# Altium project L6234 BLDC Driver.PrjPcb
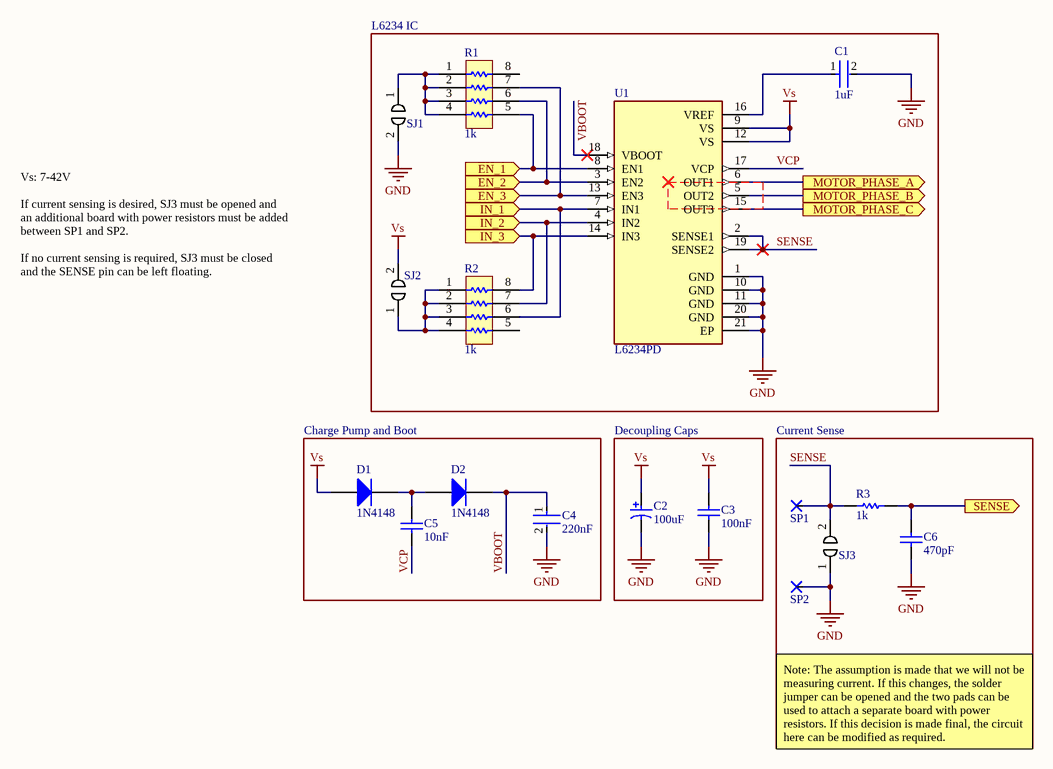
[diagram p0: L6234 BLDC Driver.SchDoc]
1 sheet, 17 parts. Net scope: flat (ports and power ports of the same name join across sheets).
Board file: L6234 BLDC Driver.PcbDoc

## Sheet L6234 BLDC Driver.SchDoc
size A4

### Parts
C1  1uF  [FP-CL21-IPC_A]
C2  100uF  [KEMT-T491-D_L]
C3  100nF  [CAPC2013X95X45ML10T25]
C4  220nF  [FP-CL549-IPC_C]
C5  10nF  [CAPC1005X55X25LL05T10]
C6  470pF  [CAPC0805(2012)75_M]
D1  1N4148  [VISH-SOD-323-2_V]
D2  1N4148  [VISH-SOD-323-2_V]
R1  1k  [BOUR-CAY16-J4_V]
R2  1k  [BOUR-CAY16-J4_V]
R3  1k  [RESC2013X70X40ML20T20]
SJ1  Jumper  [6MIL CIRCULAR]  (value not drawn)
SJ2  Jumper  [6MIL CIRCULAR]  (value not drawn)
SJ3  Jumper  [6MIL CIRCULAR]  (value not drawn)
SP1  Rectangular  [2.5x5mm]  (value not drawn)
SP2  Rectangular  [2.5x5mm]  (value not drawn)
U1  L6234PD  [SOIC127P1420X360-21N]

### Blocks framed on the sheet
L6234 IC: C1 R1 R2 SJ1 SJ2 U1
Charge Pump and Boot: C4 C5 D1 D2
Decoupling Caps: C2 C3
Current Sense: C6 R3 SJ3 SP1 SP2

### Ports
EN_1 (in), EN_2 (in), EN_3 (in), IN_1 (in), IN_2 (in), IN_3 (in), MOTOR_PHASE_A (out), MOTOR_PHASE_B (out), MOTOR_PHASE_C (out), SENSE (out)

### Nets
GND: C1.2 C2.2 C3.1 C4.2 C6.1 SJ1.2 SJ3.1 SP2.1 U1.1(GND) U1.10(GND) U1.11(GND) U1.20(GND) U1.21(EP)
Vs: C2.1 C3.2 D1.1(A) SJ2.2 U1.9(VS) U1.12(VS)
SENSE: R3.1 SJ3.2 SP1.1 U1.2(SENSE1) U1.19(SENSE2)
VBOOT: C4.1 D2.2(K) U1.18(VBOOT)
VCP: C5.1 U1.17(VCP)
NetC1_1: C1.1 U1.16(VREF)
NetC5_2: C5.2 D1.2(K) D2.1(A)
NetC6_2: C6.2 R3.2 ; port SENSE
NetR1_1: R1.1 R1.2 R1.3 R1.4 SJ1.1
NetR1_5: R1.5 U1.8(EN1) ; port EN_1
NetR1_6: R1.6 U1.3(EN2) ; port EN_2
NetR1_7: R1.7 U1.13(EN3) ; port EN_3
NetR2_1: R2.1 R2.2 R2.3 R2.4 SJ2.1
NetR2_6: R2.6 U1.7(IN1) ; port IN_1
NetR2_7: R2.7 U1.4(IN2) ; port IN_2
NetR2_8: R2.8 U1.14(IN3) ; port IN_3
NetU1_5: U1.5(OUT2) ; port MOTOR_PHASE_B
NetU1_6: U1.6(OUT1) ; port MOTOR_PHASE_A
NetU1_15: U1.15(OUT3) ; port MOTOR_PHASE_C

Not connected (* = marked no-connect by the designer): R1 8; R2 5

### Notes on the sheet
- Vs: 7-42V
  If current sensing is desired, SJ3 must be opened and an additional board with power resistors must be added between SP1 and SP2.
  If no current sensing is required, SJ3 must be closed and the SENSE pin can be left floating.
- Note: The assumption is made that we will not be measuring current. If this changes, the solder jumper can be opened and the two pads can be used to attach a separate board with power resistors. If this decision is made final, the circuit here can be modified as required.

### Library data of the parts
C1 = CMP-13271-003098-1: CL21 Series 0805 1uF 16V ±10% Tolerance X7R Multilayer Ceramic Chip Capacitor; Manufacturer: Samsung; Manufacturer Part Number: CL21B105KOFNNNE; Case Code (Metric): 2012; Width: 0.049inch; Thickness: 0.053inch; Voltage Rating: 16V; Max Operating Temperature: 125°C; Case Code (Imperial): 0805; Height: 1.25mm; Length: 2mm; Case/Package: 0805; Lead Free: Lead Free; Mount: Surface Mount; Capacitance: 1uF; Tolerance: 10%; Voltage Rating (DC): 16V; Min Operating Temperature: -55°C; Contact Plating: Tin; Depth: 1.25mm; Packaging: Tape and Reel; Package Quantity: 1; Voltage: 16V; Dielectric: X7R; Radiation Hardening: No; Supplier 1: LCSC; Supplier Part Number 1: C24123; RoHS: Yes; Category: Ceramic Capacitors; Stock 1: 102500; Pricing 1: 50=0.02040, 500=0.01510, 1500=0.01410, 5000=0.01310, 25000=0.01270, 50000=0.01250, 50=0.01950, 500=0.01440, 1500=0.01350, 5000=0.01260, 25000=0.01220, 50000=0.01200, 50=0.10220, 500=0.07570, 1500=0.07090, 5000=0.06600, 25000=0.06390, 50000=0.06280, 50=0.09230, 500=0.06840, 1500=0.06400, 5000=0.05960, 25000=0.05770, 50000=0.05670, 50=0.01240, 500=0.00920, 1500=0.00860, 5000=0.00800, 25000=0.00780, 50000=0.00760, 50=0.01130, 500=0.00830, 1500=0.00780, 5000=0.00730, 25000=0.00700, 50000=0.00690, 50=0.11320, 500=0.08390, 1500=0.07850, 5000=0.07310, 25000=0.07070, 50000=0.06950, 50=1.53440, 500=1.13720, 1500=1.06430, 5000=0.99120, 25000=0.95890, 50000=0.94280, 50=0.06190, 500=0.04590, 1500=0.04300, 5000=0.04000, 25000=0.03870, 50000=0.03810, 50=1.06060, 500=0.78600, 1500=0.73560, 5000=0.68510, 25000=0.66280, 50000=0.65170, 50=0.12760, 500=0.09450, 1500=0.08850, 5000=0.08240, 25000=0.07970, 50000=0.07840, 50=0.02010, 500=0.01490, 1500=0.01390, 5000=0.01300, 25000=0.01250, 50000=0.01230, 50=0.01460, 500=0.01082, 1500=0.01013, 5000=0.00943, 25000=0.00913, 50000=0.00897 (AUD); ComponentLink1URL: https://datasheet.ciiva.com/25800/cl21b105kofnnne-25800257.pdf?src-supplier=Digi-Key; ComponentLink1Description: https://datasheet.ciiva.com/25800/cl21b105kofnnne-25800257.pdf?src-supplier=Digi-Key; ComponentLink2URL: https://datasheet.ciiva.com/26838/getdatasheetpartid-358361-26838673.pdf?src-supplier=Verical; ComponentLink2Description: https://datasheet.ciiva.com/26838/getdatasheetpartid-358361-26838673.pdf?src-supplier=Verical; ComponentLink3URL: https://datasheet.ciiva.com/26310/mlcc-catalogdownload2013-eng-26310166.pdf?src-supplier=Distrelec; ComponentLink3Description: https://datasheet.ciiva.com/26310/mlcc-catalogdownload2013-eng-26310166.pdf?src-supplier=Distrelec; Supplier 2: Digi-Key; Supplier Part Number 2: 1276-1026-1-ND; Stock 2: 45318; Pricing 2: 1=0.10000, 10=0.06000, 50=0.03300, 100=0.02690, 500=0.01922, 1000=0.01509 (USD)
C2 = CMP-2000-07541-1: Tantalum Surface Mount Capacitor, 100 uF, +/- 10%, 16 V, -55 to 125 degC, 2917 (7343 Metric), RoHS, Tape and Reel; Manufacturer: Kemet; Manufacturer Part Number: T491D107K016AT; ESR (Equivalent Series Resistance): 700mOhm; Dissipation Factor: 8%; Voltage Rating (DC): 16V; Case\/Package: Molded; Polarity: Polar; Life (Hours): 2000Hour; Leakage Current: 16uA; Ripple Current: 463mA; RoHSCompliant: true; Datasheet Version: 07/2017; Case Code (Imperial): 2917; Width: 4.3mm; Height: 2.8mm; Min Operating Temperature: -55degC; Length: 7.3mm; Package Reference: T491-D; Dielectric Material: Tantalum; Packaging: TapeandReel; Max Operating Temperature: 125degC; Package Description: 2-Pin Surface Mount Device, Body 7.3 x 4.3 mm; Capacitance: 100uF; Package Quantity: 1; Lead Free: LeadFree; Case Code (Metric): 7343; Voltage: 16V; Voltage Rating: 16V; Tolerance: 10%; Weight: 0.023634oz; Termination: SMD/SMT; Lead Pitch: 3.6mm; Manufacturer URL: http://www.kemet.com/; Datasheet URL: http://www.kemet.com/Lists/ProductCatalog/Attachments/254/KEM_T2005_T491.pdf; Radiation Hardening: No; Mount: PCB; Height - Seated (Max): 0.122inch; Mounting Technology: SurfaceMount; Depth: 4.3mm; REACH SVHC: NoSVHC; Supplier 1: LCSC; Supplier Part Number 1: C110548; RoHS: Yes; Category: Tantalum Capacitors; Stock 1: 3642; Pricing 1: 1=0.76890, 10=0.56680, 30=0.52960, 100=0.49250, 500=0.47620, 1000=0.46920, 1=0.73630, 10=0.54280, 30=0.50720, 100=0.47160, 500=0.45600, 1000=0.44930, 1=3.86020, 10=2.84560, 30=2.65900, 100=2.47240, 500=2.39070, 1000=2.35580, 1=3.48790, 10=2.57110, 30=2.40250, 100=2.23390, 500=2.16020, 1000=2.12860, 1=0.46860, 10=0.34550, 30=0.32280, 100=0.30020, 500=0.29020, 1000=0.28600, 1=0.42510, 10=0.31340, 30=0.29280, 100=0.27230, 500=0.26330, 1000=0.25940, 1=4.27560, 10=3.15180, 30=2.94510, 100=2.73840, 500=2.64800, 1000=2.60930, 1=57.96920, 10=42.73260, 30=39.93050, 100=37.12830, 500=35.90240, 1000=35.37700, 1=2.34040, 10=1.72530, 30=1.61220, 100=1.49900, 500=1.44950, 1000=1.42830, 1=40.06930, 10=29.53750, 30=27.60060, 100=25.66370, 500=24.81630, 1000=24.45320, 1=4.81960, 10=3.55280, 30=3.31990, 100=3.08690, 500=2.98500, 1000=2.94130, 1=0.75860, 10=0.55920, 30=0.52250, 100=0.48580, 500=0.46980, 1000=0.46290, 1=0.55167, 10=0.40667, 30=0.38000, 100=0.35333, 500=0.34167, 1000=0.33667 (AUD); Case/Package: Molded; Features: General Purpose; ComponentLink1URL: https://datasheet.ciiva.com/20171/458379-da-en-01-20171921.pdf?src-supplier=Rapid+Electronics; ComponentLink1Description: https://datasheet.ciiva.com/20171/458379-da-en-01-20171921.pdf?src-supplier=Rapid+Electronics; ComponentLink2URL: https://datasheet.ciiva.com/5934/1732757-5934631.pdf?src-supplier=Farnell; ComponentLink2Description: https://datasheet.ciiva.com/5934/1732757-5934631.pdf?src-supplier=Farnell; ComponentLink3URL: https://datasheet.ciiva.com/27052/1574225-27052588.pdf?src-supplier=Jameco; ComponentLink3Description: https://datasheet.ciiva.com/27052/1574225-27052588.pdf?src-supplier=Jameco; ComponentLink4URL: https://datasheet.ciiva.com/26341/458379-da-01-en-kondensator-100uf-7343-10pr-16v-85c-26341618.pdf?src-supplier=Conrad; ComponentLink4Description: https://datasheet.ciiva.com/26341/458379-da-01-en-kondensator-100uf-7343-10pr-16v-85c-26341618.pdf?src-supplier=Conrad; ComponentLink5URL: https://datasheet.ciiva.com/260/kem-t2005-t491-260262.pdf?src-supplier=Digi-Key; ComponentLink5Description: https://datasheet.ciiva.com/260/kem-t2005-t491-260262.pdf?src-supplier=Digi-Key; ComponentLink6URL: https://datasheet.ciiva.com/260/kem-t2005-t491-260263.pdf?src-supplier=Digi-Key; ComponentLink6Description: https://datasheet.ciiva.com/260/kem-t2005-t491-260263.pdf?src-supplier=Digi-Key; ComponentLink7URL: https://datasheet.ciiva.com/41657/1854511-41657335.pdf?src-supplier=Farnell; ComponentLink7Description: https://datasheet.ciiva.com/41657/1854511-41657335.pdf?src-supplier=Farnell; ComponentLink8URL: https://datasheet.ciiva.com/260/kem-t2005-t491-260264.pdf?src-supplier=Digi-Key; ComponentLink8Description: https://datasheet.ciiva.com/260/kem-t2005-t491-260264.pdf?src-supplier=Digi-Key; ComponentLink9URL: https://datasheet.ciiva.com/14595/70095774-14595116.pdf?src-supplier=Allied+Electronics; ComponentLink9Description: https://datasheet.ciiva.com/14595/70095774-14595116.pdf?src-supplier=Allied+Electronics; ComponentLink10URL: https://datasheet.ciiva.com/7696/1854511-7696350.pdf?src-supplier=Element14; ComponentLink10Description: https://datasheet.ciiva.com/7696/1854511-7696350.pdf?src-supplier=Element14; ComponentLink11URL: https://datasheet.ciiva.com/14588/70095774-14588350.pdf?src-supplier=Allied+Electronics; ComponentLink11Description: https://datasheet.ciiva.com/14588/70095774-14588350.pdf?src-supplier=Allied+Electronics; ComponentLink12URL: https://datasheet.ciiva.com/7696/1854511-7696351.pdf?src-supplier=Element14; ComponentLink12Description: https://datasheet.ciiva.com/7696/1854511-7696351.pdf?src-supplier=Element14; Supplier 2: Digi-Key; Supplier Part Number 2: 399-3770-1-ND; Stock 2: 108039; Pricing 2: 1=1.24000, 10=0.98100, 50=0.85020, 100=0.73580 (USD)
C3 = CMP-2000-05017-1: Chip Capacitor, 0.1 uF, +/- 10%, 50 V, 0805 (2012 Metric), RoHS, Tape and Reel; Manufacturer: Samsung Electro-Mechanics; Manufacturer Part Number: CL21B104KBCNNNC; Dielectric: X7R; Capacitance: 100000pF; Rated Voltage: 50V; Material: Ceramic; Tolerance (%): ±10%; Case Size/Dimension: 0805; Datasheet URL: http://www.samsungsem.com/kr/support/product-search/mlcc/__icsFiles/afieldfile/2015/08/14/S_CL21B104KBCNNNC.pdf; Package Reference: 805; Package Description: 2-Pin Surface Mount Device, Body 2 x 1.25 mm; Manufacturer URL: http://www.samsungsem.com/global/index.jsp; Datasheet Version: Jun-15; Supplier 1: LCSC; Supplier Part Number 1: C1711; RoHS: Yes; Category: Ceramic Capacitors; Stock 1: 1085500; Pricing 1: 50=0.01270, 500=0.00920, 1500=0.00860, 5000=0.00790, 25000=0.00750, 50000=0.00740, 50=0.01220, 500=0.00880, 1500=0.00820, 5000=0.00760, 25000=0.00720, 50000=0.00710, 50=0.06380, 500=0.04610, 1500=0.04300, 5000=0.03980, 25000=0.03770, 50000=0.03730, 50=0.05760, 500=0.04170, 1500=0.03880, 5000=0.03600, 25000=0.03410, 50000=0.03370, 50=0.00770, 500=0.00560, 1500=0.00520, 5000=0.00480, 25000=0.00460, 50000=0.00450, 50=0.00700, 500=0.00510, 1500=0.00470, 5000=0.00440, 25000=0.00420, 50000=0.00410, 50=0.07060, 500=0.05110, 1500=0.04760, 5000=0.04410, 25000=0.04170, 50000=0.04140, 50=0.95740, 500=0.69290, 1500=0.64530, 5000=0.59770, 25000=0.56600, 50000=0.56070, 50=0.03870, 500=0.02800, 1500=0.02610, 5000=0.02410, 25000=0.02290, 50000=0.02260, 50=0.66180, 500=0.47890, 1500=0.44600, 5000=0.41310, 25000=0.39120, 50000=0.38760, 50=0.07960, 500=0.05760, 1500=0.05370, 5000=0.04970, 25000=0.04710, 50000=0.04660, 50=0.01250, 500=0.00910, 1500=0.00840, 5000=0.00780, 25000=0.00740, 50000=0.00730, 50=0.00911, 500=0.00659, 1500=0.00614, 5000=0.00569, 25000=0.00539, 50000=0.00534 (AUD); Mount: Surface Mount; Case/Package: 0805; Case Code (Metric): 2012; Case Code (Imperial): 0805; Contact Plating: Tin; Min Operating Temperature: -55°C; Max Operating Temperature: 125°C; Tolerance: 10%; Packaging: Tape and Reel; Voltage Rating: 50V; Voltage Rating (DC): 50V; Voltage: 50V; Length: 2mm; Height: 0.85mm; Width: 0.049inch; Depth: 1.25mm; Thickness: 0.037inch; Radiation Hardening: No; Lead Free: Lead Free; ComponentLink1URL: https://datasheet.ciiva.com/25710/cl21b104kbcnnnc-25710182.pdf?src-supplier=Digi-Key; ComponentLink1Description: https://datasheet.ciiva.com/25710/cl21b104kbcnnnc-25710182.pdf?src-supplier=Digi-Key; ComponentLink2URL: https://datasheet.ciiva.com/29199/454152-da-01-en-vs-kondensator-0805-29199814.pdf?src-supplier=Conrad; ComponentLink2Description: https://datasheet.ciiva.com/29199/454152-da-01-en-vs-kondensator-0805-29199814.pdf?src-supplier=Conrad; Supplier 2: Digi-Key; Supplier Part Number 2: 1276-1003-1-ND; Stock 2: 778357; Pricing 2: 1=0.10000, 10=0.05200, 50=0.02820, 100=0.02310, 500=0.01648, 1000=0.01295 (USD)
C4 = CMP-13271-002972-1: Cap Ceramic 220nF 16V X7R ±10% SMD 0402 +125°C Paper T/R; Manufacturer: Samsung; Manufacturer Part Number: CL05B224KO5NNNC; Capacitance: 220nF; Length: 1mm; Case Code (Metric): 1005; Dielectric: X7R; Thickness: 0.022inch; Packaging: Tape and Reel; Width: 0.02inch; Voltage Rating: 16V; Max Operating Temperature: 125°C; Tolerance: 10%; Depth: 0.5mm; Radiation Hardening: No; Case Code (Imperial): 0402; Height: 0.5mm; Package Quantity: 1; Mount: Surface Mount; Case/Package: 0402; Min Operating Temperature: -55°C; Supplier 1: LCSC; Supplier Part Number 1: C16772; RoHS: Yes; Category: Ceramic Capacitors; Stock 1: 178850; Pricing 1: 50=0.01030, 500=0.00760, 1500=0.00710, 5000=0.00660, 25000=0.00640, 50000=0.00630, 50=0.00980, 500=0.00730, 1500=0.00680, 5000=0.00630, 25000=0.00610, 50000=0.00600, 50=0.05160, 500=0.03820, 1500=0.03570, 5000=0.03330, 25000=0.03220, 50000=0.03160, 50=0.04660, 500=0.03450, 1500=0.03230, 5000=0.03010, 25000=0.02910, 50000=0.02860, 50=0.00630, 500=0.00460, 1500=0.00430, 5000=0.00400, 25000=0.00390, 50000=0.00380, 50=0.00570, 500=0.00420, 1500=0.00390, 5000=0.00370, 25000=0.00350, 50000=0.00350, 50=0.05720, 500=0.04230, 1500=0.03960, 5000=0.03680, 25000=0.03560, 50000=0.03500, 50=0.77520, 500=0.57350, 1500=0.53640, 5000=0.49940, 25000=0.48290, 50000=0.47480, 50=0.03130, 500=0.02320, 1500=0.02170, 5000=0.02020, 25000=0.01950, 50000=0.01920, 50=0.53580, 500=0.39640, 1500=0.37080, 5000=0.34520, 25000=0.33380, 50000=0.32820, 50=0.06440, 500=0.04770, 1500=0.04460, 5000=0.04150, 25000=0.04020, 50000=0.03950, 50=0.01010, 500=0.00750, 1500=0.00700, 5000=0.00650, 25000=0.00630, 50000=0.00620, 50=0.00738, 500=0.00546, 1500=0.00511, 5000=0.00475, 25000=0.00460, 50000=0.00452 (AUD); ComponentLink1URL: https://datasheet.ciiva.com/25800/cl05b224ko5nnnc-25800450.pdf?src-supplier=Digi-Key; ComponentLink1Description: https://datasheet.ciiva.com/25800/cl05b224ko5nnnc-25800450.pdf?src-supplier=Digi-Key; ComponentLink2URL: https://datasheet.ciiva.com/26838/getdatasheetpartid-358459-26838228.pdf?src-supplier=Verical; ComponentLink2Description: https://datasheet.ciiva.com/26838/getdatasheetpartid-358459-26838228.pdf?src-supplier=Verical; ComponentLink3URL: https://datasheet.ciiva.com/16428/cl05b224ko5nnnc-16428810.pdf?src-supplier=Future+Electronics; ComponentLink3Description: https://datasheet.ciiva.com/16428/cl05b224ko5nnnc-16428810.pdf?src-supplier=Future+Electronics; Supplier 2: Digi-Key; Supplier Part Number 2: 1276-1176-6-ND; Stock 2: 298107; Pricing 2: 1=0.10000, 10=0.03700, 50=0.02000, 100=0.01640, 500=0.01170, 1000=0.00920, 2500=0.00836, 5000=0.00769 (USD)
C5 = CMP-2008-04637-4: Chip Capacitor, 10 nF, +/- 10%, 50 V, -55 to 125 degC, 0402 (1005 Metric), RoHS, Tape and Reel; PartNumber: GRM155R71H103KA88D; Manufacturer: Basic Passives; Case\/Package: 0402; Voltage Rating: 50 V; Type (Capacitors): X7R; Material: Ceramic; Voltage: 25V; DatasheetVersion: 02/2016; Capacitance: 10 nF; Mount: Surface Mount; Max Operating Temperature: 125 degC; ComponentLink1Description: Manufacturer URL; Package Quantity: 10000; Mounting Technology: Surface Mount; Radiation Hardening: No; Lead Pitch: 2mm; Length: 1 mm; Tolerance: 10%; Voltage Rating (DC): 50 V; Case Code (Metric): 1005; Packaging: Tape and Reel; Pins: 2; Width: 0.5 mm; PackageDescription: 2-Pin Surface Mount Device, Body 1 x 0.5 mm; ComponentLink1URL: http://www.murata.com/; Min Operating Temperature: -55 degC; Height: 0.5 mm; RoHSCompliant: true; Case Code (Imperial): 0402; ComponentLink2URL: http://search.murata.co.jp/Ceramy/image/img/A01X/G101/ENG/GRM155R71H103KA88-01.pdf; ComponentLink2Description: Datasheet; PackageReference: 0402; REACH SVHC: No SVHC; Supplier 1: LCSC; Supplier Part Number 1: C77019; Manufacturer Part Number: GRM155R71H103KA88D; RoHS: Yes; Category: Ceramic Capacitors; Stock 1: 4900; Pricing 1: 100=0.00390, 1000=0.00290, 3000=0.00270, 10000=0.00250, 50000=0.00240, 100000=0.00240, 100=0.00380, 1000=0.00280, 3000=0.00260, 10000=0.00240, 50000=0.00230, 100000=0.00230, 100=0.01980, 1000=0.01450, 3000=0.01360, 10000=0.01260, 50000=0.01220, 100000=0.01200, 100=0.01790, 1000=0.01310, 3000=0.01230, 10000=0.01140, 50000=0.01100, 100000=0.01080, 100=0.00240, 1000=0.00180, 3000=0.00160, 10000=0.00150, 50000=0.00150, 100000=0.00150, 100=0.00220, 1000=0.00160, 3000=0.00150, 10000=0.00140, 50000=0.00130, 100000=0.00130, 100=0.02190, 1000=0.01610, 3000=0.01500, 10000=0.01400, 50000=0.01350, 100000=0.01320, 100=0.29700, 1000=0.21810, 3000=0.20360, 10000=0.18920, 50000=0.18270, 100000=0.17960, 100=0.01200, 1000=0.00880, 3000=0.00820, 10000=0.00760, 50000=0.00740, 100000=0.00730, 100=0.20530, 1000=0.15080, 3000=0.14080, 10000=0.13080, 50000=0.12630, 100000=0.12410, 100=0.02470, 1000=0.01810, 3000=0.01690, 10000=0.01570, 50000=0.01520, 100000=0.01490, 100=0.00390, 1000=0.00290, 3000=0.00270, 10000=0.00250, 50000=0.00240, 100000=0.00230, 100=0.00283, 1000=0.00208, 3000=0.00194, 10000=0.00180, 50000=0.00174, 100000=0.00171 (AUD); Case/Package: 0402; Number of Pins: 2; Dielectric: X7R; Termination: SMD/SMT; Depth: 0.5mm; Thickness: 0.022inch; Lead Free: Lead Free; ComponentLink3URL: https://datasheet.ciiva.com/129/product-129810.pdf?src-supplier=Digi-Key; ComponentLink3Description: https://datasheet.ciiva.com/129/product-129810.pdf?src-supplier=Digi-Key; ComponentLink4URL: https://datasheet.ciiva.com/19476/1856433-19476546.pdf?src-supplier=Jameco; ComponentLink4Description: https://datasheet.ciiva.com/19476/1856433-19476546.pdf?src-supplier=Jameco; ComponentLink5URL: https://datasheet.ciiva.com/11786/0900766b80ef921d-11786340.pdf?src-supplier=RSComponents; ComponentLink5Description: https://datasheet.ciiva.com/11786/0900766b80ef921d-11786340.pdf?src-supplier=RSComponents; ComponentLink6URL: https://datasheet.ciiva.com/18100/getdatasheetpartid-27434-18100660.pdf?src-supplier=Verical; ComponentLink6Description: https://datasheet.ciiva.com/18100/getdatasheetpartid-27434-18100660.pdf?src-supplier=Verical; ComponentLink7URL: https://datasheet.ciiva.com/22698/1747449-22698420.pdf?src-supplier=Element14; ComponentLink7Description: https://datasheet.ciiva.com/22698/1747449-22698420.pdf?src-supplier=Element14; ComponentLink8URL: https://datasheet.ciiva.com/29199/454225-da-01-en-vs-kondensator-0402-29199740.pdf?src-supplier=Conrad; ComponentLink8Description: https://datasheet.ciiva.com/29199/454225-da-01-en-vs-kondensator-0402-29199740.pdf?src-supplier=Conrad; ComponentLink9URL: https://datasheet.ciiva.com/129/grm155r71h103ka88-01-129811.pdf?src-supplier=Digi-Key; ComponentLink9Description: https://datasheet.ciiva.com/129/grm155r71h103ka88-01-129811.pdf?src-supplier=Digi-Key; ComponentLink10URL: https://datasheet.ciiva.com/129/grm155r71h103ka88-01-129812.pdf?src-supplier=Digi-Key; ComponentLink10Description: https://datasheet.ciiva.com/129/grm155r71h103ka88-01-129812.pdf?src-supplier=Digi-Key; ComponentLink11URL: https://datasheet.ciiva.com/16495/product-16495290.pdf?src-supplier=Future+Electronics; ComponentLink11Description: https://datasheet.ciiva.com/16495/product-16495290.pdf?src-supplier=Future+Electronics; ComponentLink12URL: https://datasheet.ciiva.com/5410/product-5410990.pdf?src-supplier=Mouser; ComponentLink12Description: https://datasheet.ciiva.com/5410/product-5410990.pdf?src-supplier=Mouser; Supplier 2: Digi-Key; Supplier Part Number 2: 490-4516-1-ND; Stock 2: 3687401; Pricing 2: 1=0.10000, 10=0.04000, 50=0.02180, 100=0.01780, 500=0.01270, 1000=0.00998, 2500=0.00908, 5000=0.00835 (USD)
C6 = CMP-1036-02670-1: CAP 470pF 50V ±10% 0805 (2012 Metric) Thickness 0.75mm SMD; Manufacturer: Yageo; Manufacturer Part Number: CC0805KRX7R9BB471; Tolerance: Â±10%; Case-Metric: 2012; Case-EIA: 0805; Material: Ceramic; Dielectric: X7R; Insulation Resistance: 100GR; Rated Voltage: 50 V; Value: 470pF; Technology: SMT; Max Thickness: 0.75 mm; Supplier 1: LCSC; Supplier Part Number 1: C107152; Supplier 2: Digi-Key; Supplier Part Number 2: 311-1124-1-ND; RoHS: Yes; Category: Ceramic Capacitors; Stock 2: 76563; Pricing 2: 1=0.12000, 10=0.08500, 50=0.04820, 100=0.04000, 500=0.02802, 1000=0.02319 (USD); Mount: Surface Mount; Case/Package: 0805; Number of Pins: 2; Case Code (Imperial): 0805; Case Code (Metric): 2012; Dielectric Material: Ceramic; Min Operating Temperature: -55°C; Max Operating Temperature: 125°C; Capacitance: 470pF; Package Quantity: 1; Voltage Rating: 50V; Voltage Rating (DC): 50V; Packaging: Tape and Reel; Termination: SMD/SMT; Composition: Ceramic; Length: 2mm; Height: 0.6mm; Depth: 1.25mm; Width: 1.25mm; Thickness: 0.024inch; Radiation Hardening: No; REACH SVHC: Unknown; Lead Free: Lead Free; Halogen Free: Halogen Free; ComponentLink1URL: https://datasheet.ciiva.com/29148/445173-da-01-en-kerko-chip-0805-x7r-470pf-10proz-50vg-29148961.pdf?src-supplier=Conrad; ComponentLink1Description: https://datasheet.ciiva.com/29148/445173-da-01-en-kerko-chip-0805-x7r-470pf-10proz-50vg-29148961.pdf?src-supplier=Conrad; ComponentLink2URL: https://datasheet.ciiva.com/144/mlccorderingcode-144598.pdf?src-supplier=Digi-Key; ComponentLink2Description: https://datasheet.ciiva.com/144/mlccorderingcode-144598.pdf?src-supplier=Digi-Key; ComponentLink3URL: https://datasheet.ciiva.com/144/mlccorderingcode-144599.pdf?src-supplier=Digi-Key; ComponentLink3Description: https://datasheet.ciiva.com/144/mlccorderingcode-144599.pdf?src-supplier=Digi-Key; ComponentLink4URL: https://datasheet.ciiva.com/144/mlccorderingcode-144600.pdf?src-supplier=Digi-Key; ComponentLink4Description: https://datasheet.ciiva.com/144/mlccorderingcode-144600.pdf?src-supplier=Digi-Key; ComponentLink5URL: https://datasheet.ciiva.com/46396/1489800-46396332.pdf?src-supplier=Element14; ComponentLink5Description: https://datasheet.ciiva.com/46396/1489800-46396332.pdf?src-supplier=Element14; ComponentLink6URL: https://datasheet.ciiva.com/15189/getdatasheetpartid-299872-15189229.pdf?src-supplier=Verical; ComponentLink6Description: https://datasheet.ciiva.com/15189/getdatasheetpartid-299872-15189229.pdf?src-supplier=Verical
D1 D2 = CMP-2000-05517-2: Small Signal Fast Switching Diode, 1.2 V, 350 mA, -55 to 150 degC, 2-Pin SOD-323, RoHS, Tape and Reel; Manufacturer: Vishay; Brand: VishaySemiconductors; Maximum Power Dissipation: 200mW; Recovery Time: 4ns; Forward Voltage Drop: 1.2V; Peak Reverse Voltage: 100V; Maximum Reverse Leakage Current: 100uA; Maximum Diode Capacitance: 4pF; Forward Continuous Current: 150mA; Package Version: Rev. 5, 09/2009; Unit Weight: 0.000152oz; Max Surge Current: 350mA; Mounting Technology: SurfaceMount; Factory Pack Quantity: 3000; Package / Case: SOD-323; Series: 1N4148WS; Product Category: Diodes-GeneralPurpose,Power,Switching; RoHS: Details; Manufacturer URL: http://www.vishay.com/; Operating Temperature Range: -55Cto+150C; Maximum Operating Temperature: +150C; Packaging: Reel; Datasheet URL: http://www.vishay.com/docs/85751/1n4148ws.pdf; Datasheet Version: Rev. 2.0, 05/2013; Product: SwitchingDiodes; Minimum Operating Temperature: -55C; Package URL: http://www.st.com/st-web-ui/static/active/en/resource/technical/document/datasheet/CD00233088.pdf; Mounting Style: SMD/SMT; Package Reference: SOD-323-2; Package Description: 2-Pin Surface Mount Device, Body 1.775 x 1.3 mm, Height 1.15 mm
R1 R2 = CMP-1747-00007-1: Chip Resistor Array, 1 KOhm, +/- 5%, 62.5 mW, -55 to 125 degC, 8-Pin SMD, RoHS, Tape and Reel; Manufacturer: Bourns; Manufacturer Part Number: CAY16-102J4LF; Power Rating: 100 mW; Tolerance: 1%; Voltage Rating (DC): 50 V; Resistance: 330 Ohm; Case\Package: 0603; Temperature Coefficient: 200ppm/°C; Number of Resistors: 4; Circuit Type: Isolated; Power Per Element: 62.5mW; RoHSCompliant: true; Case Code (Metric): 1608; Pins: 2; PackageDescription: 8-Pin Surface Mount Device, Body 1.6 x 3.2 mm, Pitch 0.8 mm; Height: 0.45 mm; Min Operating Temperature: -55 degC; ComponentLink1URL: http://www.bourns.com/; Case Code (Imperial): 0603; Packaging: Tape and Reel; PackageReference: CAY16-J4; ComponentLink1Description: Manufacturer URL; ComponentLink2Description: Datasheet; Length: 1.6 mm; Width: 0.8 mm; Max Operating Temperature: 155 degC; Mount: Surface Mount; DatasheetVersion: Sep-14; Voltage Rating: 50 V; REACH SVHC: No SVHC; ComponentLink2URL: http://www.bourns.com/pdfs/CATCAY.pdf; Package Quantity: 5000; Supplier 1: Digi-Key; Supplier Part Number 1: CAY16-102J4LFCT-ND; RoHS: Yes; Category: Resistor Arrays; Stock 1: 111755; Pricing 1: 1=0.10000, 10=0.06900, 25=0.04760, 50=0.03720, 100=0.02650, 250=0.02068, 500=0.01644, 1000=0.01166 (USD); Case/Package: 1206; Number of Pins: 8; Number of Terminals: 8; Contact Plating: Tin; Military Standard: Not; Number of Elements: 4; Termination: Convex; Number of Circuits: 4; Depth: 1.6mm; Terminal Pitch: 0.8mm; Radiation Hardening: No; ComponentLink3URL: https://datasheet.ciiva.com/11807/0900766b8064e462-11807267.pdf?src-supplier=RSComponents; ComponentLink3Description: https://datasheet.ciiva.com/11807/0900766b8064e462-11807267.pdf?src-supplier=RSComponents; ComponentLink4URL: https://datasheet.ciiva.com/19466/1979687-19466974.pdf?src-supplier=Jameco; ComponentLink4Description: https://datasheet.ciiva.com/19466/1979687-19466974.pdf?src-supplier=Jameco; ComponentLink5URL: https://datasheet.ciiva.com/15157/getdatasheetpartid-183577-15157957.pdf?src-supplier=Verical; ComponentLink5Description: https://datasheet.ciiva.com/15157/getdatasheetpartid-183577-15157957.pdf?src-supplier=Verical; ComponentLink6URL: https://datasheet.ciiva.com/1478/1849489-1478839.pdf?src-supplier=Element14; ComponentLink6Description: https://datasheet.ciiva.com/1478/1849489-1478839.pdf?src-supplier=Element14; ComponentLink7URL: https://datasheet.ciiva.com/1478/1849489-1478840.pdf?src-supplier=Element14; ComponentLink7Description: https://datasheet.ciiva.com/1478/1849489-1478840.pdf?src-supplier=Element14; ComponentLink8URL: https://datasheet.ciiva.com/30090/catcay-30090571.pdf?src-supplier=Onlinecomponents.com; ComponentLink8Description: https://datasheet.ciiva.com/30090/catcay-30090571.pdf?src-supplier=Onlinecomponents.com; ComponentLink9URL: https://datasheet.ciiva.com/6533/catcay-6533788.pdf?src-supplier=Digi-Key; ComponentLink9Description: https://datasheet.ciiva.com/6533/catcay-6533788.pdf?src-supplier=Digi-Key; ComponentLink10URL: https://datasheet.ciiva.com/6533/catcay-6533789.pdf?src-supplier=Digi-Key; ComponentLink10Description: https://datasheet.ciiva.com/6533/catcay-6533789.pdf?src-supplier=Digi-Key; ComponentLink11URL: https://datasheet.ciiva.com/6533/catcay-6533790.pdf?src-supplier=Digi-Key; ComponentLink11Description: https://datasheet.ciiva.com/6533/catcay-6533790.pdf?src-supplier=Digi-Key; ComponentLink12URL: https://datasheet.ciiva.com/3265/catcay-3265535.pdf?src-supplier=Avnet; ComponentLink12Description: https://datasheet.ciiva.com/3265/catcay-3265535.pdf?src-supplier=Avnet
R3 = CMP-1665-00008-4: Chip Resistor, 1 KOhm, +/- 1%, 0.125 W, -55 to 155 degC, 0805 (2012 Metric), RoHS, Tape and Reel; Manufacturer: Panasonic; Manufacturer Part Number: ERJ6ENF1001V; Voltage Rating: 150 V; Resistance: 1kR; Power Rating: 125mW; Temperature Coefficient: 100ppm/°C; Voltage Rating (DC): 150V; ComponentLink1URL: http://www.panasonic.com/; ComponentLink2Description: Datasheet; REACH SVHC: Yes; ComponentLink1Description: Manufacturer URL; Length: 2 mm; Height: 0.6 mm; Package Quantity: 1; PackageDescription: 2-Pin Surface Mount Device, Body 2 x 1.25 mm; Packaging: Cut Tape; PackageReference: 0805; Max Operating Temperature: 155 degC; Mounting Technology: Surface Mount; ComponentLink2URL: http://industrial.panasonic.com/cdbs/www-data/pdf/RDA0000/AOA0000C86.pdf; DatasheetVersion: 04/2015; Min Operating Temperature: -55 degC; RoHSCompliant: true; Mount: Surface Mount; Supplier 1: LCSC; Supplier Part Number 1: C79496; RoHS: Yes; Category: Chip SMD Resistors; Stock 1: 20300; Pricing 1: 50=0.01670, 500=0.01230, 1500=0.01150, 5000=0.01060, 25000=0.01030, 50000=0.01010, 50=0.01600, 500=0.01180, 1500=0.01100, 5000=0.01020, 25000=0.00980, 50000=0.00970, 50=0.08390, 500=0.06160, 1500=0.05750, 5000=0.05350, 25000=0.05160, 50000=0.05070, 50=0.07580, 500=0.05570, 1500=0.05200, 5000=0.04830, 25000=0.04670, 50000=0.04580, 50=0.01020, 500=0.00750, 1500=0.00700, 5000=0.00650, 25000=0.00630, 50000=0.00620, 50=0.00920, 500=0.00680, 1500=0.00630, 5000=0.00590, 25000=0.00570, 50000=0.00560, 50=0.09290, 500=0.06830, 1500=0.06370, 5000=0.05920, 25000=0.05720, 50000=0.05620, 50=1.25960, 500=0.92540, 1500=0.86410, 5000=0.80270, 25000=0.77550, 50000=0.76190, 50=0.05090, 500=0.03740, 1500=0.03490, 5000=0.03240, 25000=0.03130, 50000=0.03080, 50=0.87070, 500=0.63970, 1500=0.59730, 5000=0.55480, 25000=0.53600, 50000=0.52670, 50=0.10470, 500=0.07690, 1500=0.07180, 5000=0.06670, 25000=0.06450, 50000=0.06330, 50=0.01650, 500=0.01210, 1500=0.01130, 5000=0.01050, 25000=0.01010, 50000=0.01000, 50=0.01199, 500=0.00881, 1500=0.00822, 5000=0.00764, 25000=0.00738, 50000=0.00725 (AUD); Case/Package: 0805; Number of Pins: 2; Case Code (Metric): 2012; Case Code (Imperial): 0805; Contact Plating: Tin; Tolerance: 1%; Composition: Thick Film; Termination: SMD/SMT; Number of Terminations: 2; Military Standard: Not; Max Power Dissipation: 125mW; Features: Automotive AEC-Q200; Width: 1.2mm; Depth: 1.25mm; Radiation Hardening: No; Lead Free: Lead Free; ComponentLink3URL: https://datasheet.ciiva.com/34303/1988962-34303619.pdf?src-supplier=Jameco; ComponentLink3Description: https://datasheet.ciiva.com/34303/1988962-34303619.pdf?src-supplier=Jameco; ComponentLink4URL: https://datasheet.ciiva.com/11808/0900766b80f80784-11808500.pdf?src-supplier=RSComponents; ComponentLink4Description: https://datasheet.ciiva.com/11808/0900766b80f80784-11808500.pdf?src-supplier=RSComponents; ComponentLink5URL: https://datasheet.ciiva.com/28532/426256-28532134.pdf?src-supplier=Element14; ComponentLink5Description: https://datasheet.ciiva.com/28532/426256-28532134.pdf?src-supplier=Element14; ComponentLink6URL: https://datasheet.ciiva.com/30051/aoa0000ce2-30051974.pdf?src-supplier=Onlinecomponents.com; ComponentLink6Description: https://datasheet.ciiva.com/30051/aoa0000ce2-30051974.pdf?src-supplier=Onlinecomponents.com; ComponentLink7URL: https://datasheet.ciiva.com/16774/70260748-16774249.pdf?src-supplier=Allied+Electronics; ComponentLink7Description: https://datasheet.ciiva.com/16774/70260748-16774249.pdf?src-supplier=Allied+Electronics; ComponentLink8URL: https://datasheet.ciiva.com/46373/1678782-46373338.pdf?src-supplier=Element14; ComponentLink8Description: https://datasheet.ciiva.com/46373/1678782-46373338.pdf?src-supplier=Element14; ComponentLink9URL: https://datasheet.ciiva.com/7942/426256-7942429.pdf?src-supplier=Element14; ComponentLink9Description: https://datasheet.ciiva.com/7942/426256-7942429.pdf?src-supplier=Element14; ComponentLink10URL: https://datasheet.ciiva.com/16199/aoa0000ce2-16199262.pdf?src-supplier=Future+Electronics; ComponentLink10Description: https://datasheet.ciiva.com/16199/aoa0000ce2-16199262.pdf?src-supplier=Future+Electronics; ComponentLink11URL: https://datasheet.ciiva.com/9117/aoa0000ce2-9117391.pdf?src-supplier=Avnet; ComponentLink11Description: https://datasheet.ciiva.com/9117/aoa0000ce2-9117391.pdf?src-supplier=Avnet; ComponentLink12URL: https://datasheet.ciiva.com/16523/aoa0000ce2-16523855.pdf?src-supplier=Avnet+Asia; ComponentLink12Description: https://datasheet.ciiva.com/16523/aoa0000ce2-16523855.pdf?src-supplier=Avnet+Asia; Supplier 2: Digi-Key; Supplier Part Number 2: P1.00KCCT-ND; Stock 2: 1019601; Pricing 2: 1=0.10000, 10=0.06900, 100=0.02650, 1000=0.01166, 2500=0.01007 (USD)
SJ1-SJ3 = Jumper: Solder Jumper to connect or disconnect a trace.
U1 = L6234PD: Motor Driver BiCDMOS Parallel PowerSO-20; MF: STMicroelectronics; Package: SOIC-20 STMicroelectronics; Value: *; Availability: Unavailable; SnapEDA_Link: https://www.snapeda.com/parts/L6234PD/STMicroelectronics/view-part/161873/?ref=snap; Price: None; MP: L6234PD